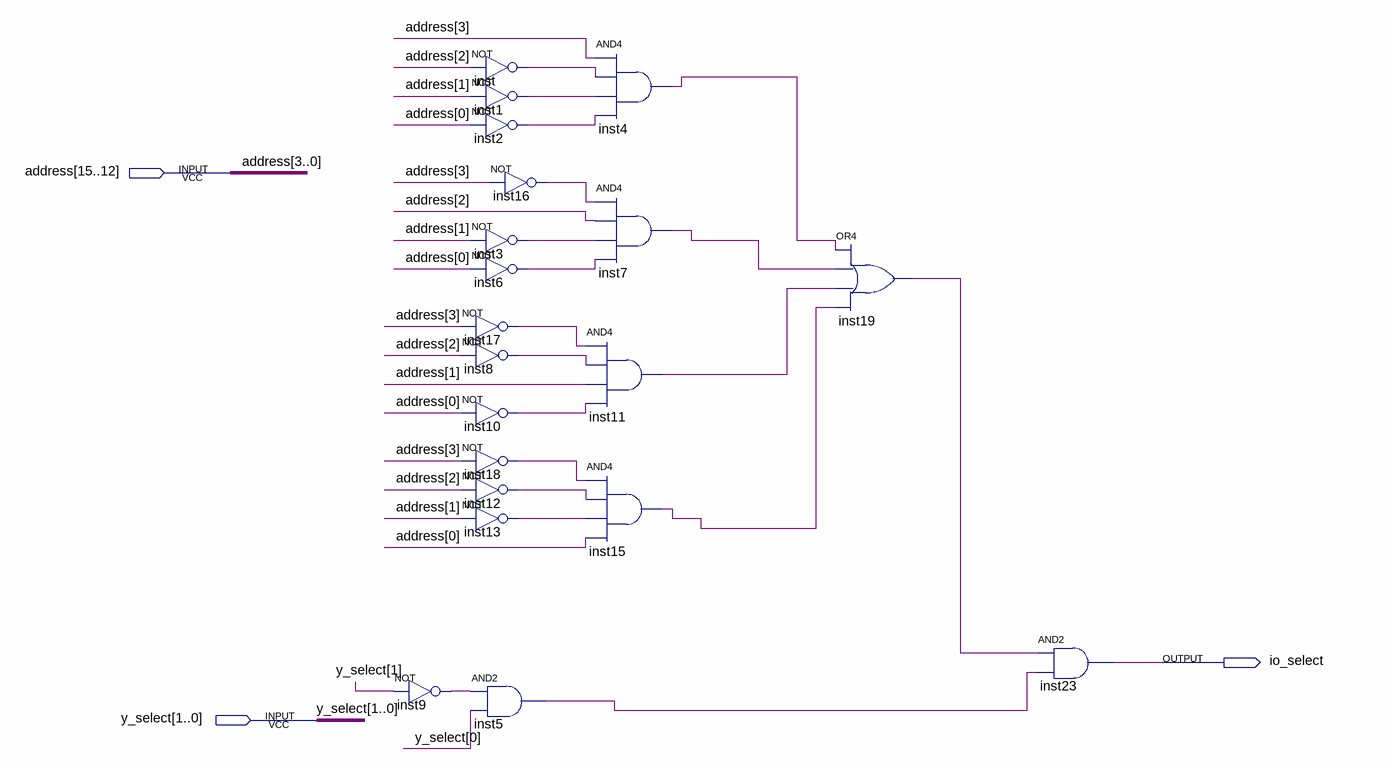
[diagram p0: schematic sheet]
// Quartus schematic iodetector.bdf as structural Verilog: 20 symbols, 3 pins
module iodetector (
  input  [15:12] address,
  input  [1:0] y_select,
  output io_select
);

  wire inst1_out, inst2_out, inst3_out, inst4_out, inst5_out, inst6_out, inst7_out, inst8_out, inst9_out,
       inst10_out, inst11_out, inst12_out, inst13_out, inst15_out, inst16_out, inst17_out, inst18_out,
       inst19_out, inst_out;

  not inst9 (inst9_out, y_select[1]);
  not inst (inst_out, address[14]);
  not inst1 (inst1_out, address[13]);
  not inst2 (inst2_out, address[12]);
  not inst16 (inst16_out, address[15]);
  not inst3 (inst3_out, address[13]);
  not inst6 (inst6_out, address[12]);
  not inst17 (inst17_out, address[15]);
  not inst8 (inst8_out, address[14]);
  not inst10 (inst10_out, address[12]);
  not inst18 (inst18_out, address[15]);
  not inst12 (inst12_out, address[14]);
  not inst13 (inst13_out, address[13]);
  and inst5 (inst5_out, inst9_out, y_select[0]);
  and inst4 (inst4_out, address[15], inst_out, inst1_out, inst2_out);
  and inst7 (inst7_out, inst16_out, address[14], inst3_out, inst6_out);
  and inst11 (inst11_out, inst17_out, inst8_out, address[13], inst10_out);
  and inst15 (inst15_out, inst18_out, inst12_out, inst13_out, address[12]);
  or inst19 (inst19_out, inst4_out, inst7_out, inst11_out, inst15_out);
  and inst23 (io_select, inst19_out, inst5_out);

  // Other names for the same wires on the sheet: address[3:0] = address
endmodule
